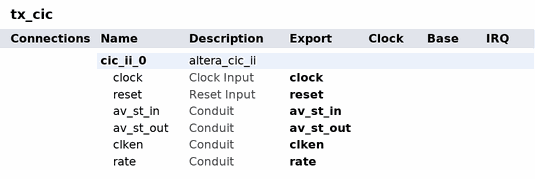
[diagram p0: system contents]
# Platform Designer (Qsys) system tx_cic, Cyclone IV E EP4CE22E22C8
# Parameters at their usual value, and those the tool derives, are not listed.
package require -exact qsys 22.1
create_system tx_cic
set_project_property DEVICE_FAMILY {Cyclone IV E}
set_project_property DEVICE EP4CE22E22C8

add_instance cic_ii_0 altera_cic_ii 22.1
set_instance_property cic_ii_0 AUTO_EXPORT true
set_instance_parameter_value cic_ii_0 CH_PER_INT 2
set_instance_parameter_value cic_ii_0 CLK_EN_PORT true
set_instance_parameter_value cic_ii_0 D_DELAY 1
set_instance_parameter_value cic_ii_0 FILTER_TYPE interpolator
set_instance_parameter_value cic_ii_0 INTERFACES 1
set_instance_parameter_value cic_ii_0 IN_WIDTH 16
set_instance_parameter_value cic_ii_0 RCF_FIX 2272
set_instance_parameter_value cic_ii_0 RCF_LB 1600
set_instance_parameter_value cic_ii_0 RCF_UB 2240
set_instance_parameter_value cic_ii_0 REQ_DIF_MEM logic_element
set_instance_parameter_value cic_ii_0 REQ_INT_MEM logic_element
set_instance_parameter_value cic_ii_0 REQ_OUT_WIDTH 14
set_instance_parameter_value cic_ii_0 REQ_PIPELINE 0
set_instance_parameter_value cic_ii_0 ROUND_TYPE CONV_ROUND
set_instance_parameter_value cic_ii_0 STAGES 4
set_instance_parameter_value cic_ii_0 VRC_EN 1
set_instance_parameter_value cic_ii_0 design_env NATIVE
set_instance_parameter_value cic_ii_0 hyper_opt_select 0
set_instance_parameter_value cic_ii_0 selected_device_family {Cyclone IV E}

# exported interfaces
add_interface av_st_in conduit end
set_interface_property av_st_in EXPORT_OF cic_ii_0.av_st_in
add_interface av_st_out conduit end
set_interface_property av_st_out EXPORT_OF cic_ii_0.av_st_out
add_interface clken conduit end
set_interface_property clken EXPORT_OF cic_ii_0.clken
add_interface clock clock sink
set_interface_property clock EXPORT_OF cic_ii_0.clock
add_interface rate conduit end
set_interface_property rate EXPORT_OF cic_ii_0.rate
add_interface reset reset sink
set_interface_property reset EXPORT_OF cic_ii_0.reset

set_interconnect_requirement {$system} qsys_mm.clockCrossingAdapter HANDSHAKE
set_interconnect_requirement {$system} qsys_mm.enableEccProtection FALSE
set_interconnect_requirement {$system} qsys_mm.insertDefaultSlave FALSE
set_interconnect_requirement {$system} qsys_mm.maxAdditionalLatency 1

save_system tx_cic.qsys
